# Altium schematic sheet Isolated_power_supply.SchDoc: Isolated_power_supply
size A4; Author: Luis; Organization: UNICAMP / LCEE; Address1: University of Campinas - Brazil; Address2: Power Conditioning Laboratory; Address3: Licensed by GNU GPL 3.0; ProjectName: Easy Inverter
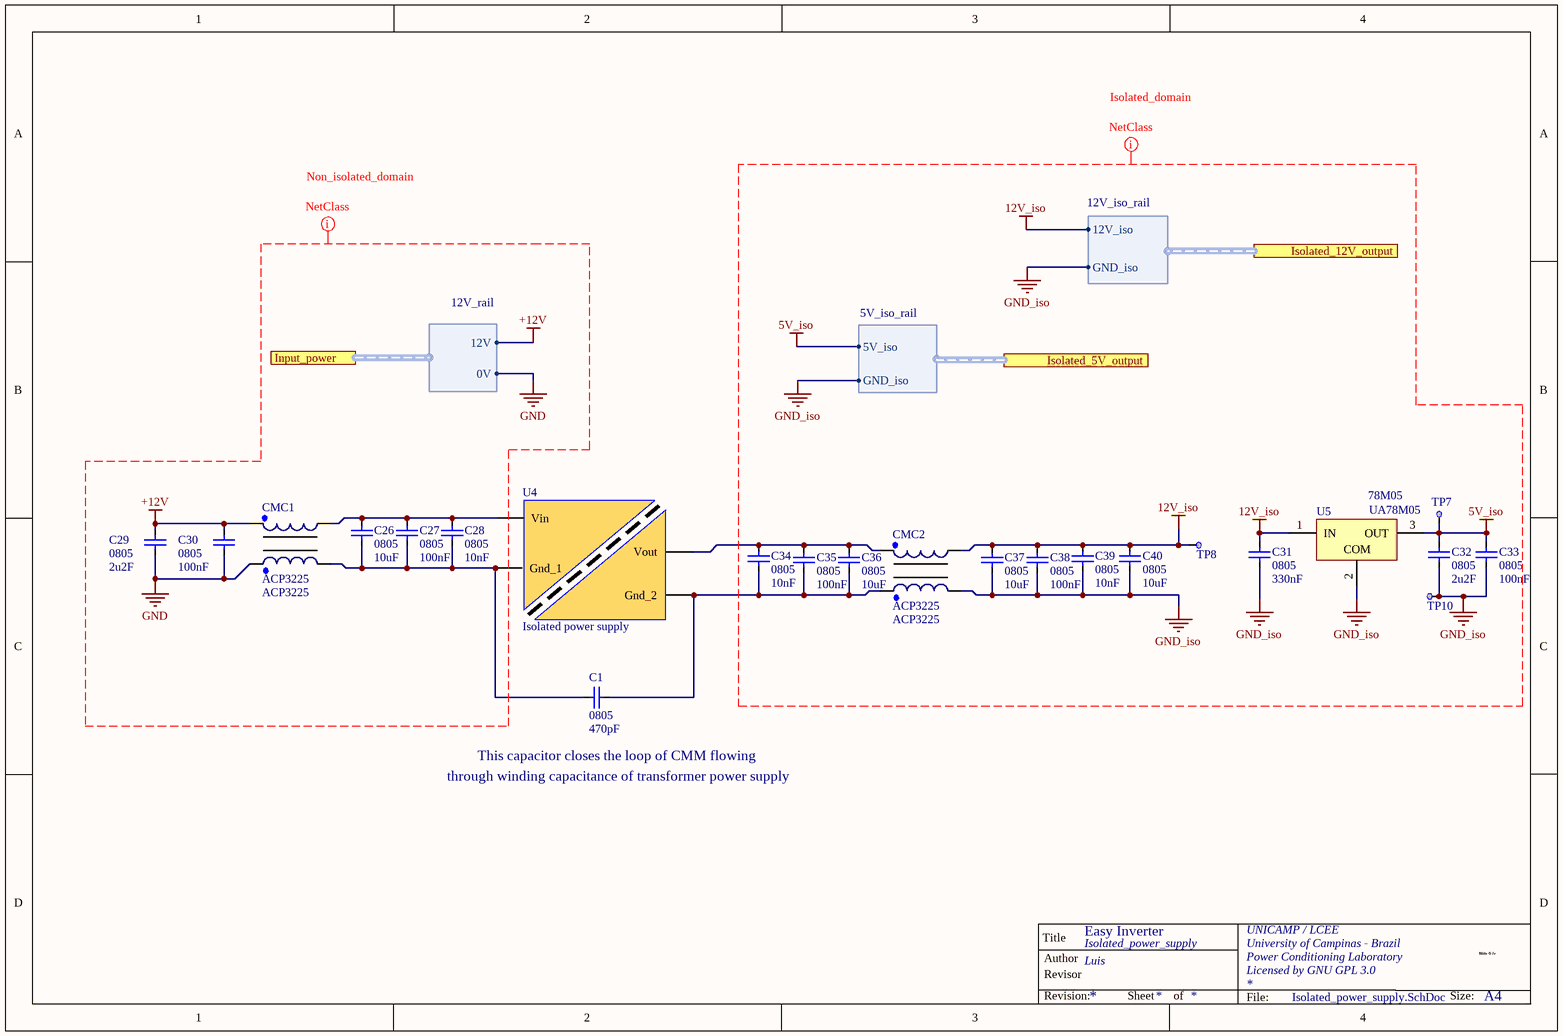
[diagram p0: Isolated_power_supply.SchDoc]

## Parts
C1  0805  value 470pF  [Capacitor 1206]
C26  0805  value 10uF  [Capacitor 0805]
C27  0805  value 100nF  [Capacitor 0805]
C28  0805  value 10nF  [Capacitor 0805]
C29  0805  value 2u2F  [Capacitor 0805]
C30  0805  value 100nF  [Capacitor 0805]
C31  0805  value 330nF  [Capacitor 0805]
C32  0805  value 2u2F  [Capacitor 0805]
C33  0805  value 100nF  [Capacitor 0805]
C34  0805  value 10nF  [Capacitor 0805]
C35  0805  value 100nF  [Capacitor 0805]
C36  0805  value 10uF  [Capacitor 0805]
C37  0805  value 10uF  [Capacitor 0805]
C38  0805  value 100nF  [Capacitor 0805]
C39  0805  value 10nF  [Capacitor 0805]
C40  0805  value 10uF  [Capacitor 0805]
CMC1  ACP3225  [ACP3225]
CMC2  ACP3225  [ACP3225]
TP7  Name of signal  [Test point]  (value not drawn)  (no BOM)
TP8  Name of signal  [Test point]  (value not drawn)  (no BOM)
TP10  Name of signal  [Test point]  (value not drawn)  (no BOM)
U4  Isolated power supply  [RE-1215S/P]
U5  78M05  value UA78M05  [SOT233-4]

## Ports
Input_power (harness 12V_rail), Isolated_5V_output (harness 5V_iso_rail), Isolated_12V_output (harness 12V_iso_rail)

## Harnesses
5V_iso_rail: GND_iso, 5V_iso
12V_rail: 0V, 12V
12V_iso_rail: GND_iso, 12V_iso

## Nets
5V_iso: C32.1 C33.1 TP7.1 U5.3(OUT) ; port Isolated_5V_output.5V_iso
12V_iso: C31.1 C37.1 C38.1 C39.1 C40.1 CMC2.4 TP8.1 U5.1(IN) ; port Isolated_12V_output.12V_iso
+12V: C29.1 C30.1 CMC1.1 ; port Input_power.12V
GND: C29.2 C30.2 CMC1.2 ; port Input_power.0V
GND_iso: C31.2 C32.2 C33.2 C37.2 C38.2 C39.2 C40.2 CMC2.3 TP10.1 U5.2(COM) ; port Isolated_5V_output.GND_iso, port Isolated_12V_output.GND_iso
NetC1_1: C1.1 C26.2 C27.2 C28.2 CMC1.3 U4.2(Gnd_1)
NetC1_2: C1.2 C34.2 C35.2 C36.2 CMC2.2 U4.4(Gnd_2)
NetC26_1: C26.1 C27.1 C28.1 CMC1.4 U4.1(Vin)
NetC34_1: C34.1 C35.1 C36.1 CMC2.1 U4.6(Vout)

## Layout directives
net class Isolated_domain: 5V_iso, 12V_iso, GND_iso
net class Non_isolated_domain: +12V, GND

## Notes on the sheet
- through winding capacitance of transformer power supply
- (near C1) This capacitor closes the loop of CMM flowing
- Title
- Author
- Revisor
- Hildo G Jr
- Revision:
- Sheet
- of
- File:
- Size:
- A4
- HGJr

## Library data of the parts
C1 = Capacitor 1206: SMD ceramic capacitor 1206; pn: undefined; ClassName: Direct_plane_connect
C26-C40 = Capacitor 0805: SMD ceramic capacitor 0805; pn: undefined
  C26 C28 C34 C35 C37-C40: ClassName: Direct_plane_connect
CMC1 CMC2 = ACP3225: SMD Commom Mode Choke (2A 500 Ohm @ 1MHz or 1.5A 1 kOhm @ 1MHz); pn: ACP3225-102-2P-T000, ACP3225-501-2P-T000; ComponentLink2Description: Datasheet; ComponentLink2URL: http://www.we-online.de/katalog/media/pdf/744862180.pdf; Value: ACP3225
TP7 = Test point: Test point to probe with oscilloscope; Signal_name: 5V; ClassName: *
TP8 = Test point: Test point to probe with oscilloscope; Signal_name: 12V; ClassName: *
TP10 = Test point: Test point to probe with oscilloscope; Signal_name: 0V; ClassName: Direct_plane_connect
U4 = RE-1215S/P: Isolated DC/DC converter 1W 12VIN 15VOUT; pn: RE-1215S/P; ComponentLink1Description: Datasheet; ComponentLink1URL: https://www.recom-power.com/pdf/Econoline/RE.pdf; Value: RE-1215S
U5 = UA78M05CDCYR: IC REG LINEAR 5V 500MA SOT223-4; ComponentLink1Description: Datasheet; ComponentLink1URL: http://www.ti.com/general/docs/lit/getliterature.tsp?genericPartNumber=UA78L05A&fileType=pdf; ComponentLink2Description: Package Specification; ComponentLink2URL: http://www.ti.com/litv/pdf/msot002a; ComponentLink3Description: URL Link1; ComponentLink3URL: Samples URL:http://www.ti.com/product/ua78l05a; pn: UA78M05CDCY